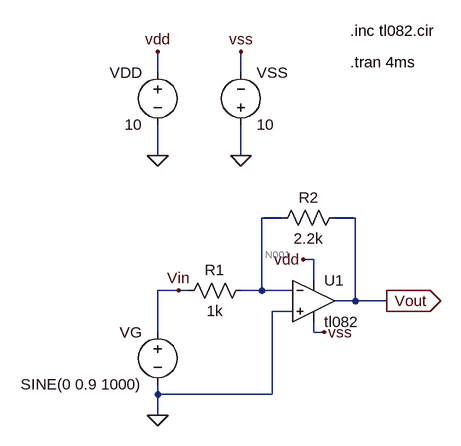
[diagram p0: schematic Inv.asc]
Inv.asc, the LTspice schematic file:
Version 4
SHEET 1 948 680
WIRE -64 -176 -64 -208
WIRE 64 -176 64 -208
WIRE -64 -48 -64 -96
WIRE 64 -48 64 -96
WIRE 128 48 96 48
WIRE 240 48 208 48
WIRE 176 112 160 112
WIRE 176 144 176 112
WIRE -32 160 -64 160
WIRE -16 160 -32 160
WIRE 96 160 96 48
WIRE 96 160 64 160
WIRE 144 160 96 160
WIRE 240 176 240 48
WIRE 240 176 208 176
WIRE 288 176 240 176
WIRE 144 192 112 192
WIRE -64 224 -64 160
WIRE 176 224 176 208
WIRE 192 224 176 224
WIRE -64 320 -64 304
WIRE 112 320 112 192
WIRE 112 320 -64 320
WIRE -64 352 -64 320
FLAG -64 352 0
FLAG -64 -48 0
FLAG 64 -48 0
FLAG -64 -208 vdd
FLAG 160 112 vdd
FLAG 64 -208 vss
FLAG 192 224 vss
FLAG -32 160 Vin
FLAG 288 176 Vout
IOPIN 288 176 Out
SYMBOL voltage -64 208 M0
WINDOW 123 0 0 Left 2
WINDOW 39 0 0 Left 2
SYMATTR InstName VG
SYMATTR Value SINE(0 0.9 1000)
SYMBOL voltage -64 -192 M0
SYMATTR InstName VDD
SYMATTR Value 10
SYMBOL voltage 64 -80 M180
WINDOW 0 24 96 Left 2
WINDOW 3 24 16 Left 2
SYMATTR InstName VSS
SYMATTR Value 10
SYMBOL Opamps\\opamp2 176 112 R0
SYMATTR InstName U1
SYMATTR Value tl082
SYMBOL res -32 176 R270
WINDOW 0 32 56 VTop 2
WINDOW 3 0 56 VBottom 2
SYMATTR InstName R1
SYMATTR Value 1k
SYMBOL res 112 64 R270
WINDOW 0 32 56 VTop 2
WINDOW 3 0 56 VBottom 2
SYMATTR InstName R2
SYMATTR Value 2.2k
TEXT 232 -240 Left 2 !.inc tl082.cir
TEXT 232 -192 Left 2 !.tran 4ms

The netlist it stands for:
* Inv.asc
VG Vin 0 SINE(0 0.9 1000)
VDD vdd 0 10
VSS 0 vss 10
XU1 0 N001 vdd vss Vout tl082  ; pins In+ In- V+ V- OUT
R1 Vin N001 1k
R2 N001 Vout 2.2k
.inc tl082.cir
.tran 4ms
.backanno
.end

* Results of the author's LTspice run, read from the files saved beside the schematic
* Operating Point, zero values left out:
*   V(vdd) = 10 V
*   V(vss) = -10 V
*   V(vout) = 35.19 µV
*   V(n001) = 10.97 µV
*   I(R2) = -11.01 nA
*   I(R1) = -10.97 nA
*   I(Vss) = -9.528 mA
*   I(Vdd) = -9.528 mA
*   I(Vg) = 10.97 nA
*   Ix(u1:1) = 40.05 pA
*   Ix(u1:2) = 40.05 pA
*   Ix(u1:3) = 9.528 mA
*   Ix(u1:4) = -9.528 mA
*   Ix(u1:5) = -11.01 nA
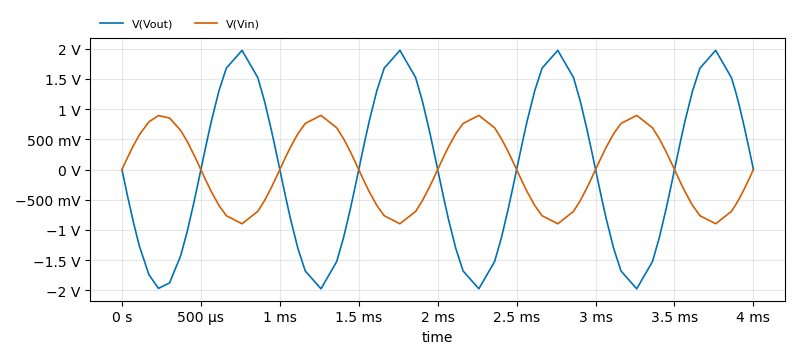
[diagram p1: Transient Analysis of Inv.asc, plotted from the saved traces]
* Transient Analysis, 1 run:
*   V(Vout): min -1.973 V, max 1.973 V, average -1.464 mV, rms 1.375 V, last 1.999 mV
*   V(Vin): min -897 mV, max 897 mV, average 681.7 µV, rms 625.2 mV, last 0 V